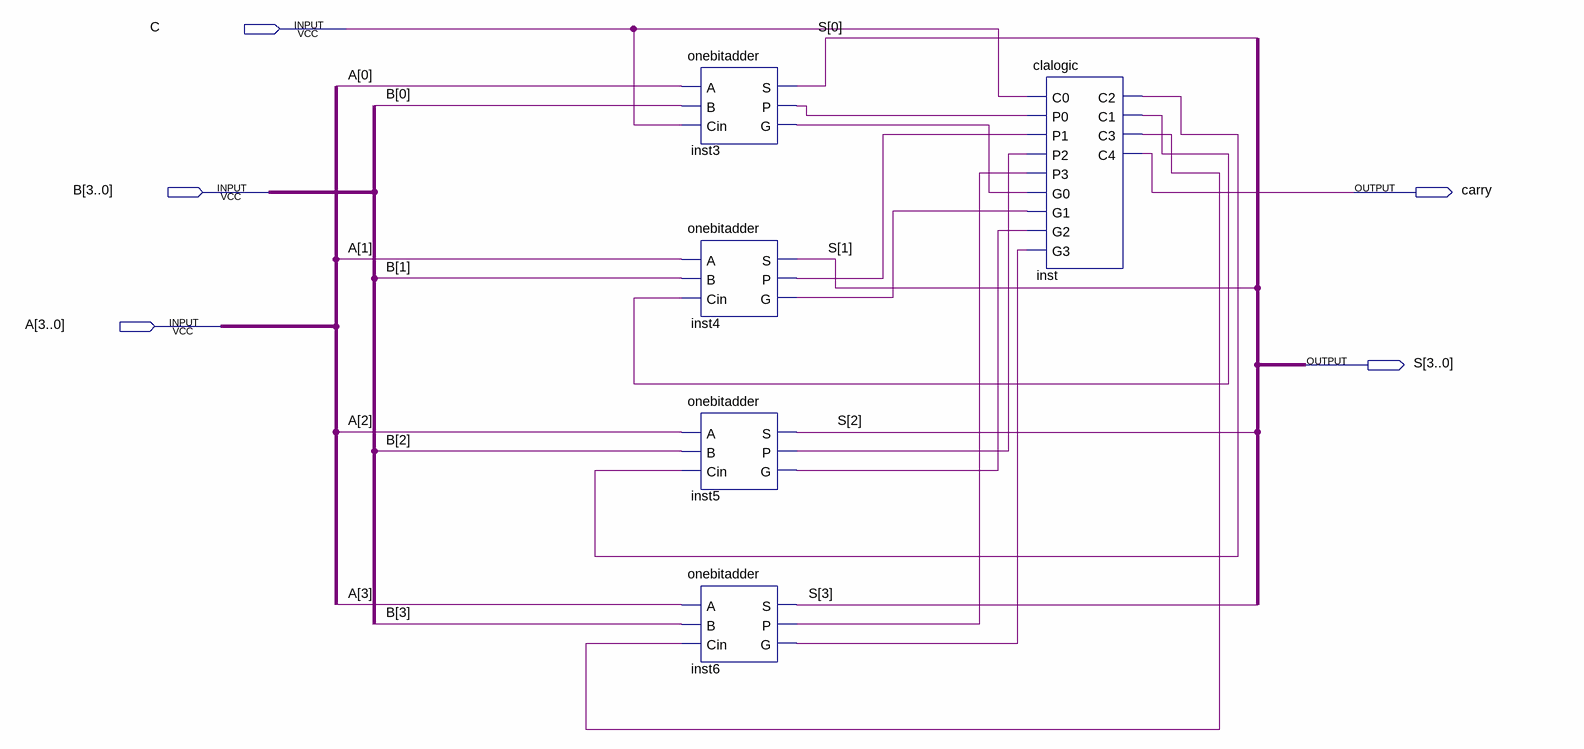
[diagram p0: schematic sheet]
// Quartus schematic finalfourbitadder.bdf as structural Verilog: 5 symbols, 5 pins
module finalfourbitadder (
  input  C,
  input  [3:0] B,
  input  [3:0] A,
  output carry,
  output [3:0] S
);

  wire inst3_g, inst3_p, inst4_g, inst4_p, inst5_g, inst5_p, inst6_g, inst6_p, inst_c1, inst_c2, inst_c3;

  onebitadder inst3 (.A(A[0]), .B(B[0]), .Cin(C), .S(S[0]), .P(inst3_p), .G(inst3_g));
  onebitadder inst4 (.A(A[1]), .B(B[1]), .Cin(inst_c1), .S(S[1]), .P(inst4_p), .G(inst4_g));
  onebitadder inst5 (.A(A[2]), .B(B[2]), .Cin(inst_c2), .S(S[2]), .P(inst5_p), .G(inst5_g));
  onebitadder inst6 (.A(A[3]), .B(B[3]), .Cin(inst_c3), .S(S[3]), .P(inst6_p), .G(inst6_g));
  clalogic inst (
    .C0(C), .P0(inst3_p), .P1(inst4_p), .P2(inst5_p), .P3(inst6_p), .G0(inst3_g), .G1(inst4_g), .G2(inst5_g),
    .G3(inst6_g), .C2(inst_c2), .C1(inst_c1), .C3(inst_c3), .C4(carry));
endmodule
